# EAGLE design 8-Kanal-DIN-BASE_V2 (EAGLE 6.4)
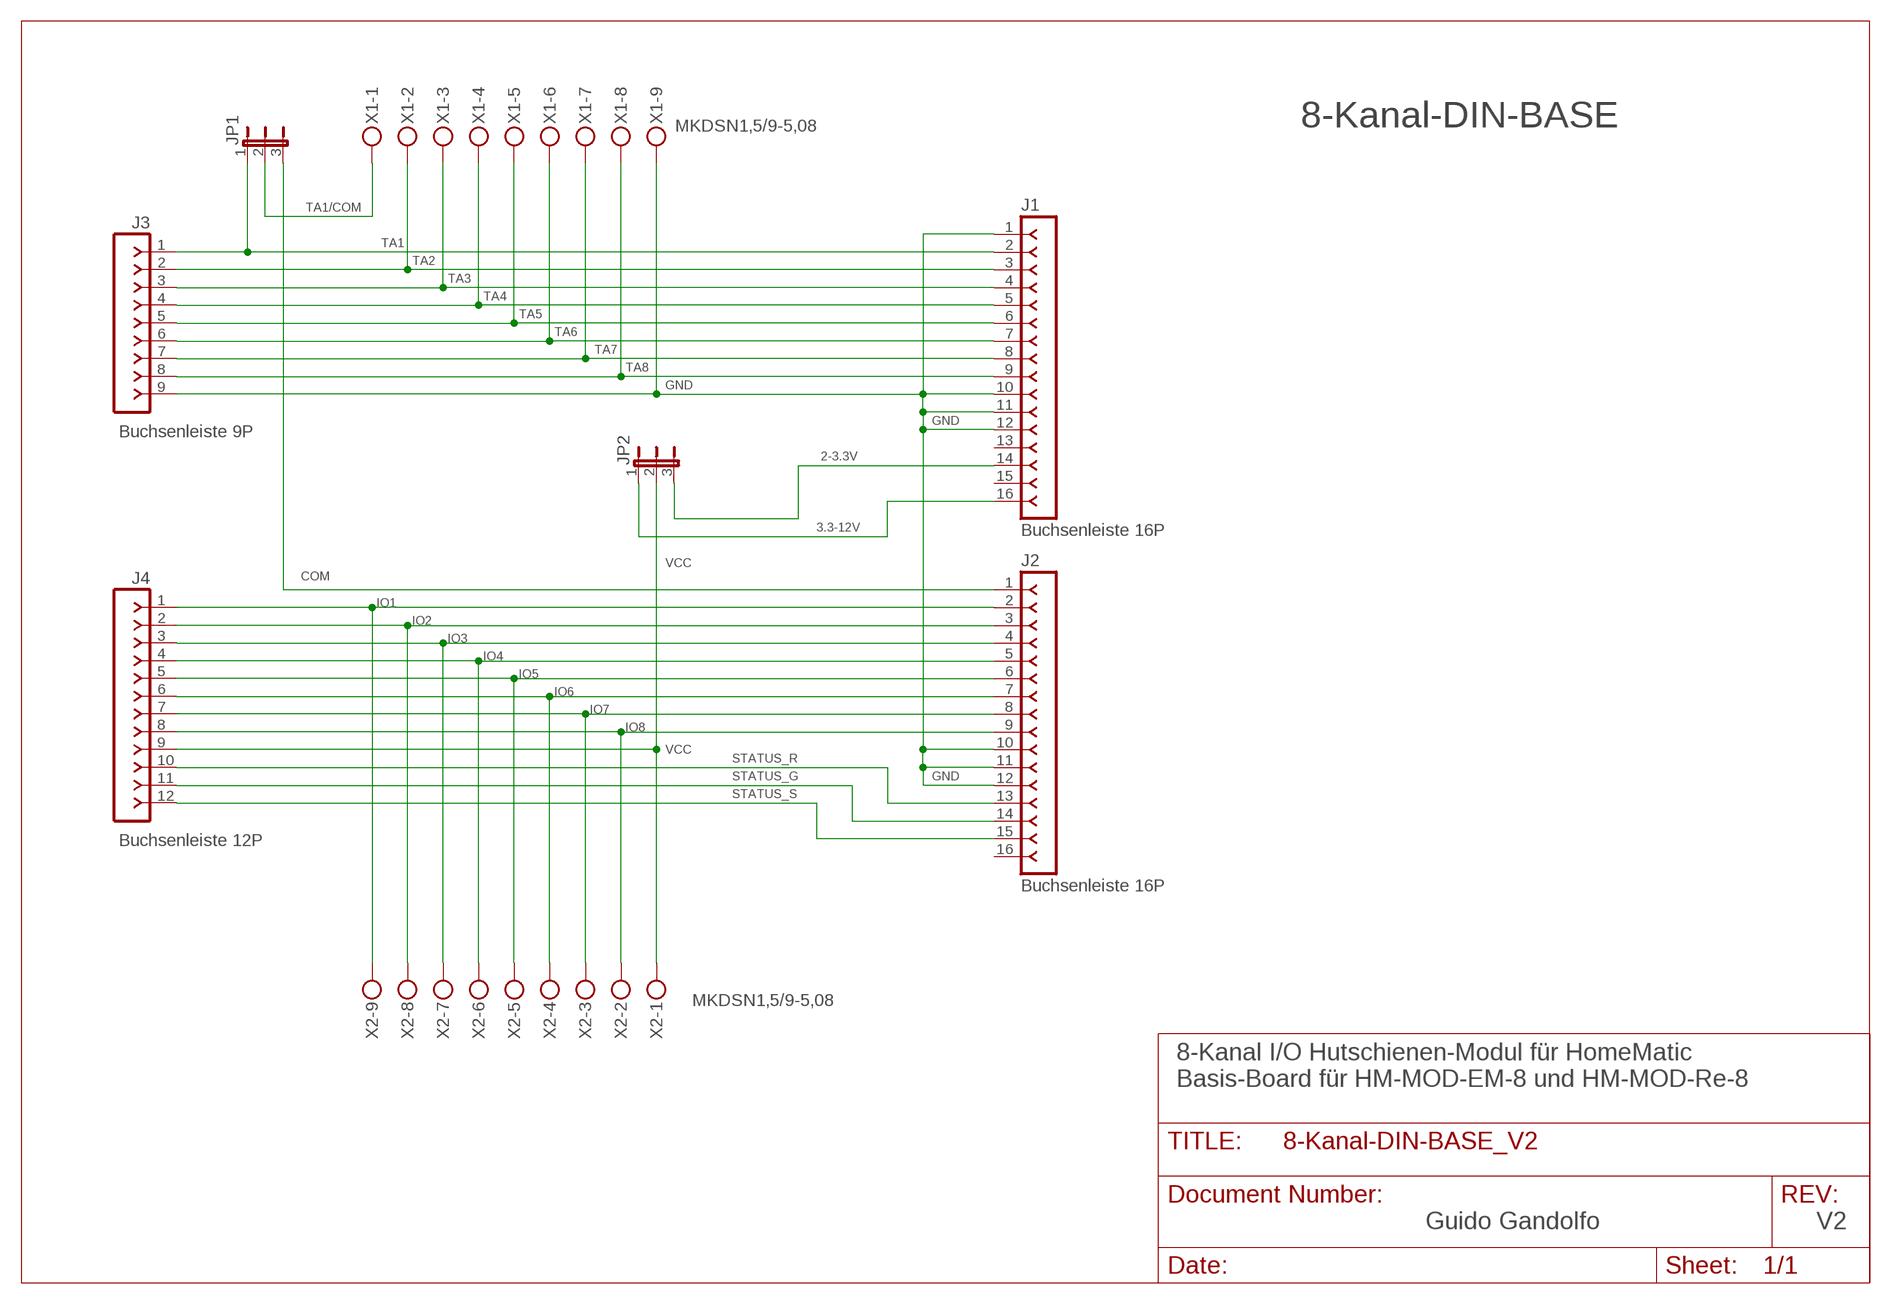
[diagram p0: schematic, sheet 1]

## Parts
J1  Buchsenleiste 16P  F-1X16-SIP-100-40Y  [SIP-100-16-40Y]
J2  Buchsenleiste 16P  F-1X16-SIP-100-40Y  [SIP-100-16-40Y]
J3  Buchsenleiste 9P  F-1X09-SIP-100-40Y  [SIP-100-09-40Y]
J4  Buchsenleiste 12P  F-1X12-SIP-100-40Y  [SIP-100-12-40Y]
JP1  JP2E  [JP2]
JP2  JP2E  [JP2]
X1  MKDSN1,5/9-5,08  [MKDSN1,5/9-5,08]
X2  MKDSN1,5/9-5,08  [MKDSN1,5/9-5,08]

## Nets
2-3.3V: J1.14 JP2.3
3.3-12V: J1.16 JP2.1
COM: J2.1 JP1.3
GND: J1.1 J1.10 J1.11 J1.12 J2.10 J2.11 J2.12 J3.9 X1.9
IO1: J2.2 J4.1 X2.9
IO2: J2.3 J4.2 X2.8
IO3: J2.4 J4.3 X2.7
IO4: J2.5 J4.4 X2.6
IO5: J2.6 J4.5 X2.5
IO6: J2.7 J4.6 X2.4
IO7: J2.8 J4.7 X2.3
IO8: J2.9 J4.8 X2.2
STATUS_G: J2.14 J4.11
STATUS_R: J2.13 J4.10
STATUS_S: J2.15 J4.12
TA1: J1.2 J3.1 JP1.1
TA1/COM: JP1.2 X1.1
TA2: J1.3 J3.2 X1.2
TA3: J1.4 J3.3 X1.3
TA4: J1.5 J3.4 X1.4
TA5: J1.6 J3.5 X1.5
TA6: J1.7 J3.6 X1.6
TA7: J1.8 J3.7 X1.7
TA8: J1.9 J3.8 X1.8
VCC: J4.9 JP2.2 X2.1
Unconnected: J1.13 J1.15 J2.16

## Notes on the sheet
- 8-Kanal-DIN-BASE
- 8-Kanal I/O Hutschienen-Modul für HomeMatic
  Basis-Board für HM-MOD-EM-8 und HM-MOD-Re-8
- Guido Gandolfo | V2

## Library data of the parts
J1 J2 = con-headers-jp:F-1X16-: FEMALE HEADER
J3 = con-headers-jp:F-1X09-: FEMALE HEADER
J4 = con-headers-jp:F-1X12-: FEMALE HEADER
JP1 JP2 = jumper:JP2E: JUMPER
X1 X2 = con-phoenix-508:MKDSN1,5/9-5,08: MKDSN 1,5/ 9-5,08 Printklemme Nennstrom: 13,5 A Nennspannung: 250 V Rastermaß: 5,08 mm Polzahl: 9 Anschlussart: Schraubanschluss Montage: Löten Anschlussrichtung Leiter/Platine: 0 ° Artikelnummer: 1729199 Source: http://eshop.phoenixcontact.com .. 1729199.pdf; MPN: SMKDSN1,5/9-5,08; OC_FARNELL: 1792912; OC_NEWARK: 70R0305

## Board
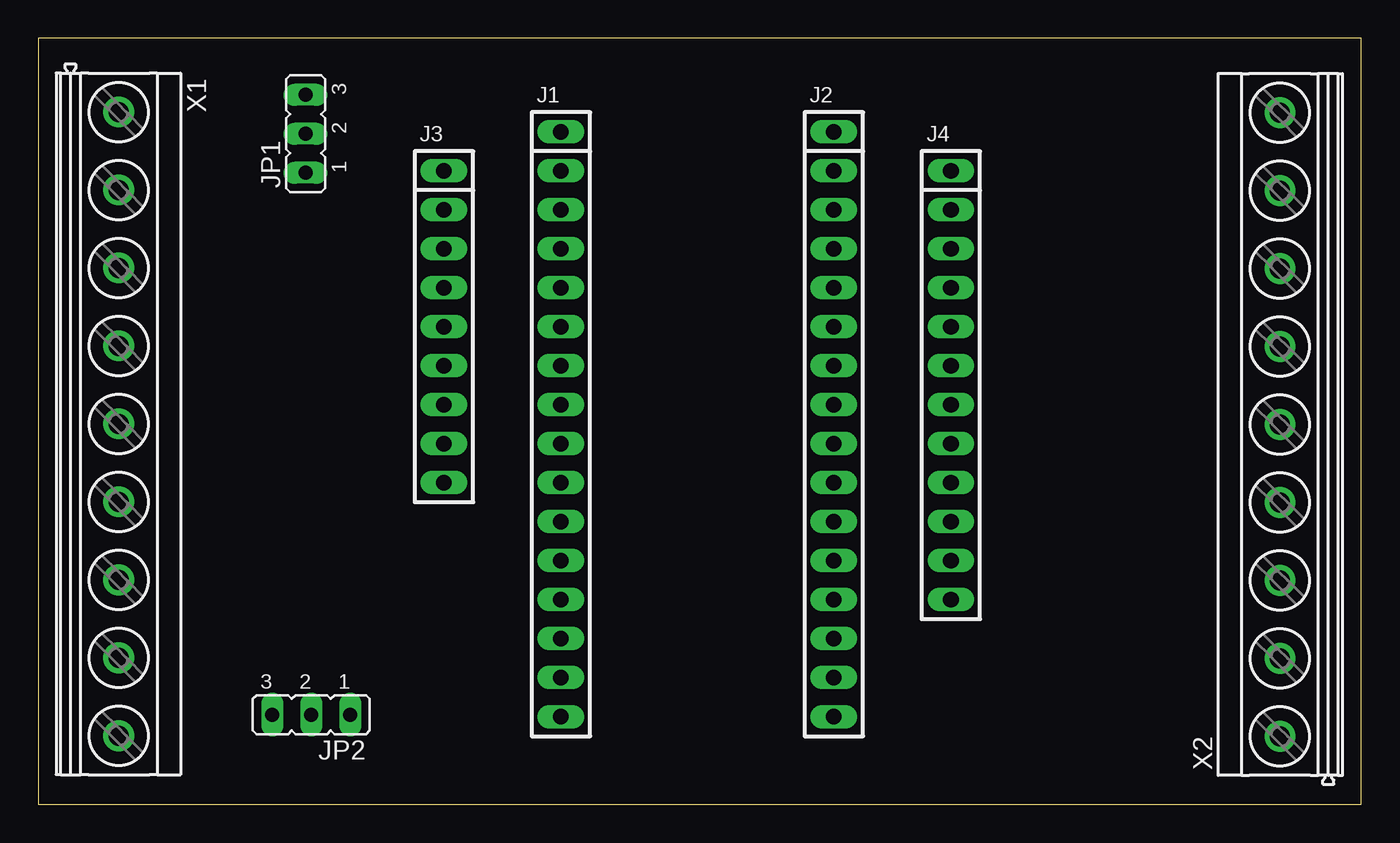
[diagram p1: board, top side]
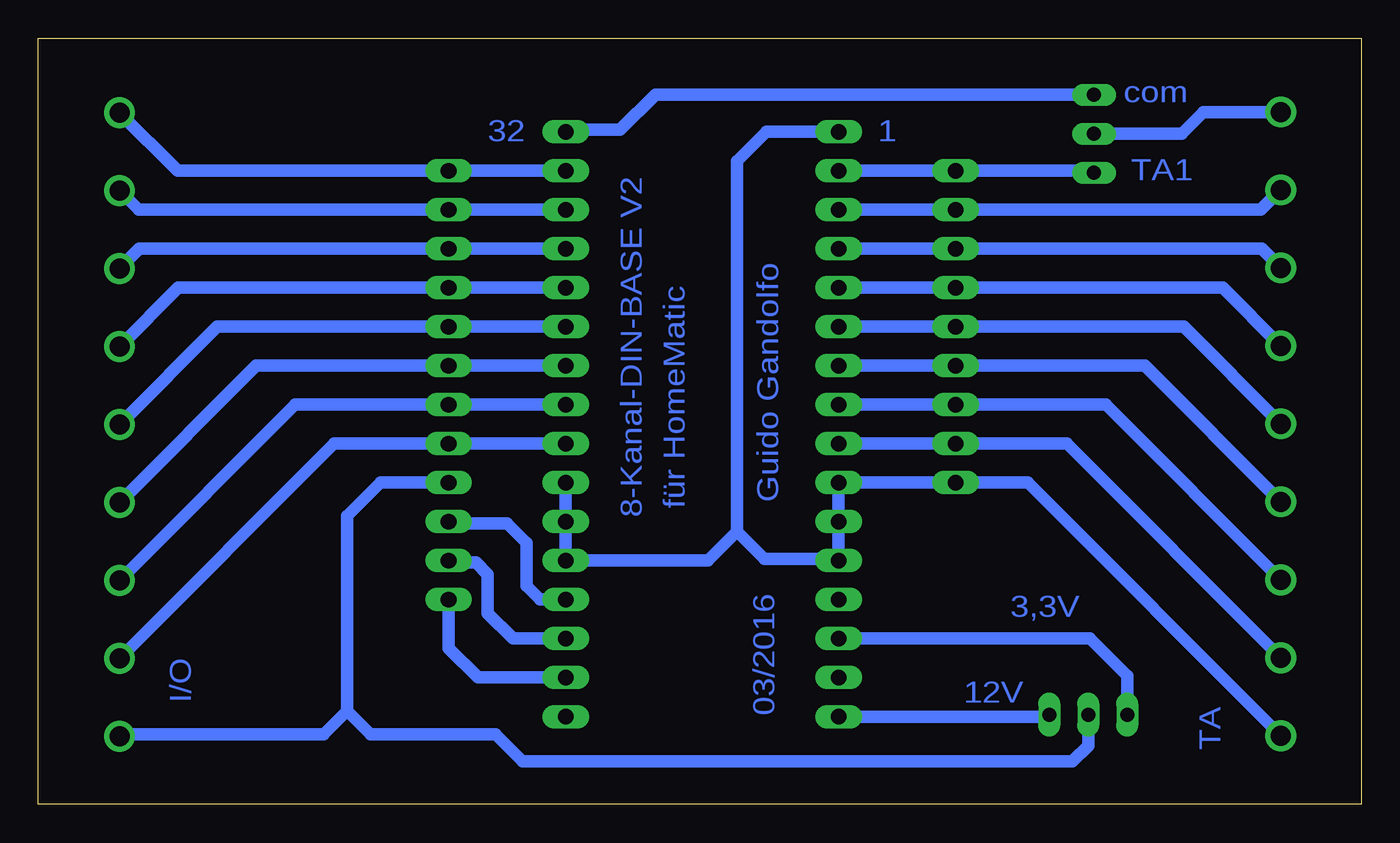
[diagram p2: board, bottom side, seen from below]

Size 86.16 x 49.9 mm. Coordinates in mm from the lower left corner, seen from the top.
Outline: 0,0 86.16,0 86.16,49.9 0,49.9 0,0
Copper layers (1*16): Top 0.035mm / dielectric 1.5mm / Bottom 0.035mm
Design rules "default": minimum track width 10mil, minimum drill 24mil, track to track 8mil, track to pad 8mil, pad to pad 8mil, via to via 8mil, smd to smd 8mil, copper to edge 40mil, drill to drill 8mil, minimum pad ring 10mil, minimum via ring 8mil, stop-mask expansion 4mil, vias tented up to drill 0mil, thermal gap 10mil

### Footprints (pad centres in the part's own frame; a part is rotated, then mirrored left to right if it is on the bottom)
SIP-100-16-40Y = drill 1.016 long: 1 -19.05,0; 2 -16.51,0; 3 -13.97,0; 4 -11.43,0; 5 -8.89,0; 6 -6.35,0; 7 -3.81,0; 8 -1.27,0; 9 1.27,0; 10 3.81,0; 11 6.35,0; 12 8.89,0; 13 11.43,0; 14 13.97,0; 15 16.51,0; 16 19.05,0
SIP-100-09-40Y = drill 1.016 long: 1 -10.16,0; 2 -7.62,0; 3 -5.08,0; 4 -2.54,0; 5 0,0; 6 2.54,0; 7 5.08,0; 8 7.62,0; 9 10.16,0
SIP-100-12-40Y = drill 1.016 long: 1 -13.97,0; 2 -11.43,0; 3 -8.89,0; 4 -6.35,0; 5 -3.81,0; 6 -1.27,0; 7 1.27,0; 8 3.81,0; 9 6.35,0; 10 8.89,0; 11 11.43,0; 12 13.97,0
JP2 = drill 0.914 long: 1 -2.54,0; 2 0,0; 3 2.54,0
MKDSN1,5/9-5,08 = drill 1.3 pad 2: 1 -20.341,0.025; 2 -15.261,0.025; 3 -10.181,0.025; 4 -5.101,0.025; 5 -0.021,0.025; 6 5.059,0.025; 7 10.139,0.025; 8 15.219,0.025; 9 20.299,0.025

### Placement (x,y rotation side)
J1  34.04,24.77 270 top
J2  51.82,24.77 270 top
J3  26.42,31.11 270 top
J4  59.44,27.3 270 top
JP1  17.4,43.69 90 top
JP2  17.78,5.84 180 top
X1  5.21,24.77 270 top
X2  80.9,24.77 90 top

### Tracks (layer width: path | path; a pad name or v marks a point on that pad's centre or on a via)
2-3.3V
  Bottom 0.813: J1.14 17.65,10.79 15.24,8.38 JP2.3
3.3-12V
  Bottom 0.813: J1.16 20.45,5.71 JP2.1
COM
  Bottom 0.813: JP1.3 45.97,46.23 48.26,43.94 51.69,43.94 J2.1
GND
  Bottom 0.813: J1.1 38.73,43.81 40.64,41.91 40.64,17.78 | 40.64,17.78 38.86,16 34.16,16 J1.12 J1.11 J1.10 | 34.16,20.83 J1.10 | 40.64,17.78 42.55,15.88 J2.12 J2.11 J2.10 | X1.9 21.72,20.95 J3.9 J1.10
IO1
  Bottom 0.813: J2.2 J4.1 77.09,41.27 X2.9
IO2
  Bottom 0.813: J2.3 J4.2 79.62,38.73 X2.8
IO3
  Bottom 0.813: J2.4 J4.3 79.58,36.2 X2.7
IO4
  Bottom 0.813: J2.5 J4.4 77.04,33.66 X2.6
IO5
  Bottom 0.813: J2.6 J4.5 74.5,31.11 X2.5
IO6
  Bottom 0.813: J2.7 J4.6 71.96,28.57 X2.4
IO7
  Bottom 0.813: J2.8 J4.7 69.42,26.04 X2.3
IO8
  Bottom 0.813: J2.9 J4.8 66.88,23.5 X2.2
STATUS_G
  Bottom 0.813: J2.14 55.24,10.79 56.9,12.45 56.9,14.99 57.66,15.75 59.31,15.75 J4.11
STATUS_R
  Bottom 0.813: J2.13 53.47,13.34 54.36,14.22 54.36,17.02 55.63,18.29 59.31,18.29 J4.10
STATUS_S
  Bottom 0.813: J2.15 57.53,8.26 59.44,10.16 J4.12
TA1
  Bottom 0.813: J1.2 J3.1 17.53,41.27 JP1.1
TA1/COM
  Bottom 0.813: X1.1 10.27,45.11 11.68,43.69 JP1.2
TA2
  Bottom 0.813: J1.3 J3.2 6.52,38.73 X1.2
TA3
  Bottom 0.61: 34.02,36.22 J1.4
  Bottom 0.813: 34.04,36.22 J1.4 | 34.02,36.22 26.44,36.22 J3.3 6.48,36.2 X1.3
TA4
  Bottom 0.813: J1.5 J3.4 9.02,33.66 X1.4
TA5
  Bottom 0.813: J1.6 J3.5 11.56,31.11 X1.5
TA6
  Bottom 0.813: J1.7 J3.6 14.1,28.57 X1.6
TA7
  Bottom 0.813: J1.8 J3.7 16.64,26.04 X1.7
TA8
  Bottom 0.813: J1.9 J3.8 19.18,23.5 X1.8
VCC
  Bottom 0.813: JP2.2 17.78,3.81 18.8,2.79 54.61,2.79 56.39,4.57 64.52,4.57 66.04,6.1 | 80.47,4.57 X2.1 80.73,4.57 67.56,4.57 66.04,6.1 | J4.9 63.88,20.95 66.04,18.8 66.04,6.1

### Text on the board
Bottom: com | 1 | 32 | TA1 | 8-Kanal-DIN-BASE V2 | Guido Gandolfo | für HomeMatic | 03/2016 | 3,3V | 12V | I/O | TA